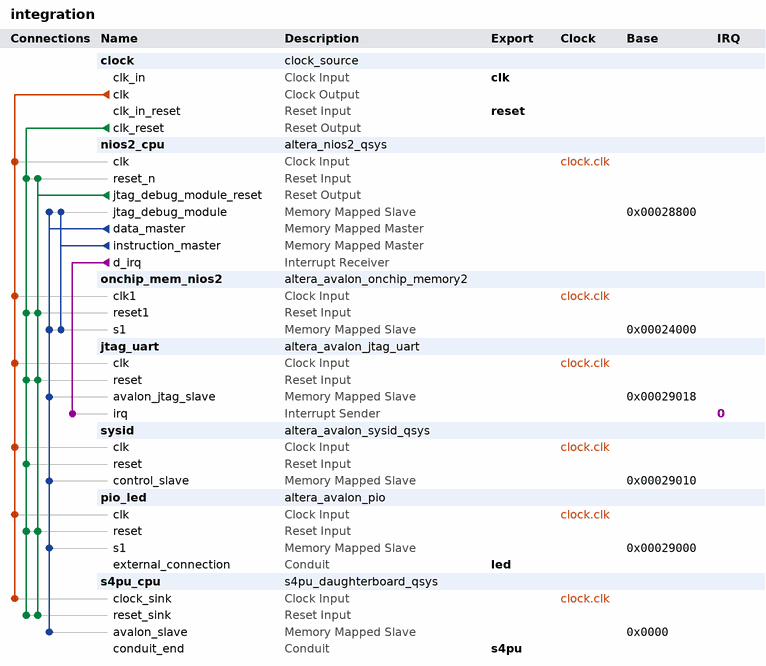
[diagram p0: system contents]
# Platform Designer (Qsys) system integration, Cyclone II EP2C35F672C6
# Parameters at their usual value, and those the tool derives, are not listed.
package require -exact qsys 13.0
create_system integration
set_project_property DEVICE_FAMILY {Cyclone II}
set_project_property DEVICE EP2C35F672C6

add_instance clock clock_source 13.0
set_instance_parameter_value clock clockFrequency 50000000

add_instance nios2_cpu altera_nios2_qsys 13.0
set_instance_parameter_value nios2_cpu resetSlave onchip_mem_nios2.s1
set_instance_parameter_value nios2_cpu mmu_TLBMissExcSlave None
set_instance_parameter_value nios2_cpu exceptionSlave onchip_mem_nios2.s1
set_instance_parameter_value nios2_cpu breakSlave nios2_cpu.jtag_debug_module
set_instance_parameter_value nios2_cpu muldiv_multiplierType NoneSmall
set_instance_parameter_value nios2_cpu impl Small
set_instance_parameter_value nios2_cpu icache_size 4096

add_instance onchip_mem_nios2 altera_avalon_onchip_memory2 13.0.1.99.2
set_instance_parameter_value onchip_mem_nios2 dataWidth 32
set_instance_parameter_value onchip_mem_nios2 dualPort false
set_instance_parameter_value onchip_mem_nios2 initMemContent true
set_instance_parameter_value onchip_mem_nios2 initializationFileName onchip_mem_nios2.hex
set_instance_parameter_value onchip_mem_nios2 instanceID NIOS
set_instance_parameter_value onchip_mem_nios2 memorySize 10240

add_instance jtag_uart altera_avalon_jtag_uart 13.0.1.99.2
set_instance_parameter_value jtag_uart simInteractiveOptions NO_INTERACTIVE_WINDOWS

add_instance sysid altera_avalon_sysid_qsys 13.0
set_instance_parameter_value sysid id 1395937365

add_instance pio_led altera_avalon_pio 13.0.1.99.2
set_instance_parameter_value pio_led direction Output
set_instance_parameter_value pio_led resetValue 12598
set_instance_parameter_value pio_led width 16

add_instance s4pu_cpu s4pu_daughterboard_qsys 16.0
set_instance_parameter_value s4pu_cpu ARCH 16

# connections
add_connection clock.clk jtag_uart.clk clock
add_connection clock.clk nios2_cpu.clk clock
add_connection clock.clk onchip_mem_nios2.clk1 clock
add_connection clock.clk pio_led.clk clock
add_connection clock.clk s4pu_cpu.clock_sink clock
add_connection clock.clk sysid.clk clock
add_connection clock.clk_reset jtag_uart.reset reset
add_connection clock.clk_reset nios2_cpu.reset_n reset
add_connection clock.clk_reset onchip_mem_nios2.reset1 reset
add_connection clock.clk_reset pio_led.reset reset
add_connection clock.clk_reset s4pu_cpu.reset_sink reset
add_connection clock.clk_reset sysid.reset reset
add_connection nios2_cpu.jtag_debug_module_reset jtag_uart.reset reset
add_connection nios2_cpu.jtag_debug_module_reset nios2_cpu.reset_n reset
add_connection nios2_cpu.jtag_debug_module_reset onchip_mem_nios2.reset1 reset
add_connection nios2_cpu.jtag_debug_module_reset pio_led.reset reset
add_connection nios2_cpu.jtag_debug_module_reset s4pu_cpu.reset_sink reset
add_connection nios2_cpu.data_master jtag_uart.avalon_jtag_slave avalon
set_connection_parameter_value nios2_cpu.data_master/jtag_uart.avalon_jtag_slave baseAddress 0x00029018
add_connection nios2_cpu.data_master nios2_cpu.jtag_debug_module avalon
set_connection_parameter_value nios2_cpu.data_master/nios2_cpu.jtag_debug_module baseAddress 0x00028800
add_connection nios2_cpu.data_master onchip_mem_nios2.s1 avalon
set_connection_parameter_value nios2_cpu.data_master/onchip_mem_nios2.s1 baseAddress 0x00024000
add_connection nios2_cpu.data_master pio_led.s1 avalon
set_connection_parameter_value nios2_cpu.data_master/pio_led.s1 baseAddress 0x00029000
add_connection nios2_cpu.data_master s4pu_cpu.avalon_slave avalon
set_connection_parameter_value nios2_cpu.data_master/s4pu_cpu.avalon_slave baseAddress 0x0000
add_connection nios2_cpu.data_master sysid.control_slave avalon
set_connection_parameter_value nios2_cpu.data_master/sysid.control_slave baseAddress 0x00029010
add_connection nios2_cpu.instruction_master nios2_cpu.jtag_debug_module avalon
set_connection_parameter_value nios2_cpu.instruction_master/nios2_cpu.jtag_debug_module baseAddress 0x00028800
add_connection nios2_cpu.instruction_master onchip_mem_nios2.s1 avalon
set_connection_parameter_value nios2_cpu.instruction_master/onchip_mem_nios2.s1 baseAddress 0x00024000
add_connection nios2_cpu.d_irq jtag_uart.irq interrupt
set_connection_parameter_value nios2_cpu.d_irq/jtag_uart.irq irqNumber 0

# exported interfaces
add_interface clk clock sink
set_interface_property clk EXPORT_OF clock.clk_in
add_interface reset reset sink
set_interface_property reset EXPORT_OF clock.clk_in_reset
add_interface led conduit end
set_interface_property led EXPORT_OF pio_led.external_connection
add_interface s4pu conduit end
set_interface_property s4pu EXPORT_OF s4pu_cpu.conduit_end

set_interconnect_requirement {$system} qsys_mm.clockCrossingAdapter HANDSHAKE
set_interconnect_requirement {$system} qsys_mm.maxAdditionalLatency 1

save_system integration.qsys
